# EAGLE design board (EAGLE 6.5.0)
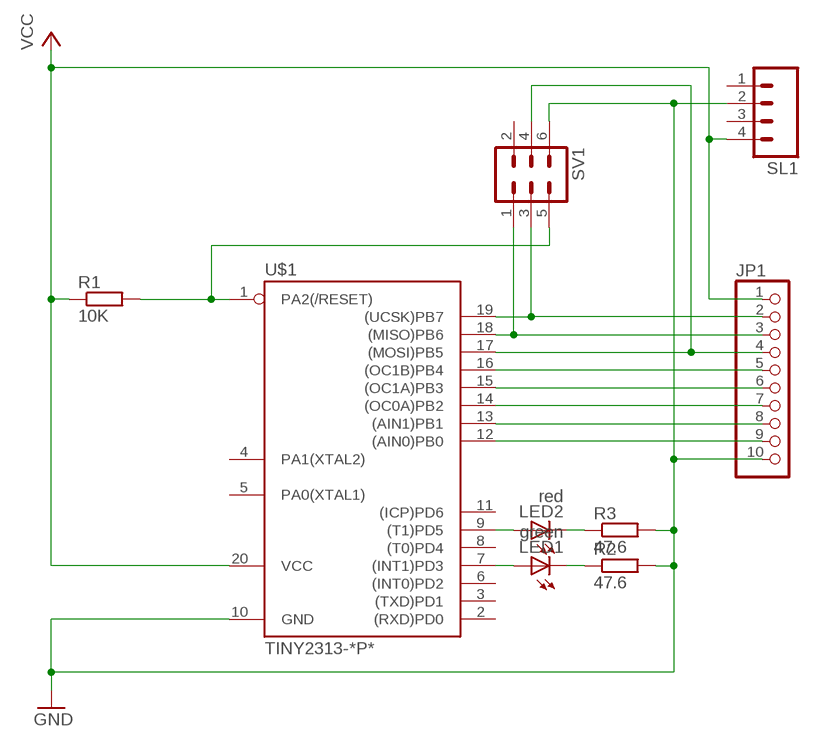
[diagram p0: schematic, sheet 1]

## Parts
JP1  PINHD-1X10  [1X10]
LED1  green  LED3MM  [LED3MM]
LED2  red  LED3MM  [LED3MM]
R1  10K  R-EU_0207/2V  [0207/2V]
R2  47.6  R-EU_0207/2V  [0207/2V]
R3  47.6  R-EU_0207/2V  [0207/2V]
SL1  M04  [04P]
SV1  ML6  [ML6]
U$1  TINY2313-*P*  [DIL20]

## Nets
GND: JP1.10 R2.2 R3.2 SL1.2 SV1.6 U$1.10(GND)
N$1: R1.2 SV1.5 U$1.1(PA2(/RESET))
N$2: LED2.A U$1.9((T1)PD5)
N$3: LED1.K(C) R2.1
N$4: LED1.A U$1.7((INT1)PD3)
N$5: LED2.K(C) R3.1
N$6: JP1.3 SV1.1 U$1.18((MISO)PB6)
N$7: JP1.2 SV1.3 U$1.19((UCSK)PB7)
N$9: JP1.4 SV1.4 U$1.17((MOSI)PB5)
N$12: JP1.5 U$1.16((OC1B)PB4)
N$13: JP1.6 U$1.15((OC1A)PB3)
N$14: JP1.7 U$1.14((OC0A)PB2)
N$15: JP1.8 U$1.13((AIN1)PB1)
N$16: JP1.9 U$1.12((AIN0)PB0)
VCC: JP1.1 R1.1 SL1.4 U$1.20(VCC)
Unconnected: SL1.1 SL1.3 SV1.2 U$1.2((RXD)PD0) U$1.3((TXD)PD1) U$1.4(PA1(XTAL2)) U$1.5(PA0(XTAL1)) U$1.6((INT0)PD2) U$1.8((T0)PD4) U$1.11((ICP)PD6)

## Library data of the parts
JP1 = pinhead:PINHD-1X10: PIN HEADER
LED1 LED2 = led:LED: LED OSRAM: - CHIPLED LG R971, LG N971, LY N971, LG Q971, LY Q971, LO R971, LY R971 LH N974, LH R974 LS Q976, LO Q976, LY Q976 LO Q996 - Hyper CHIPLED LW Q18S LB Q993, LB Q99A, LB R99A - SideLED LS A670, LO A670, LY A670, LG A670, LP A670 LB A673, LV A673, LT A673, LW A673 LH A674 LY A675 LS A676, LA A676, LO A676, LY A676, LW A676 LS A679, LY A679, LG A679 - Hyper Micro SIDELED® LS Y876, LA Y876, LO Y876, LY Y876 LT Y87S - SmartLED LW L88C, LW L88S LB L89C, LB L89S, LG L890 LS L89K, LO L89K, LY L89K LS L896, LA L896, LO L896, LY L896 - TOPLED LS T670, LO T670, LY T670, LG T670, LP T670 LSG T670, LSP T670, LSY T670, LOP T670, LYG T670 LG T671, LOG T671, LSG T671 LB T673, LV T673, LT T673, LW T673 LH T674 LS T676, LA T676, LO T676, LY T676, LB T676, LH T676, LSB T676, LW T676 LB T67C, LV T67C, LT T67C, LS T67K, LO T67K, LY T67K, LW E67C LS E67B, LA E67B, LO E67B, LY E67B, LB E67C, LV E67C, LT E67C LW T67C LS T679, LY T679, LG T679 LS T770, LO T770, LY T770, LG T770, LP T770 LB T773, LV T773, LT T773, LW T773 LH T774 LS E675, LA E675, LY E675, LS T675 LS T776, LA T776, LO T776, LY T776, LB T776 LHGB T686 LT T68C, LB T68C - Hyper Mini TOPLED® LB M676 - Mini TOPLED Santana® LG M470 LS M47K, LO M47K, LY M47K Source: http://www.osram.convergy.de LUXEON: - LUMILED® LXK2-PW12-R00, LXK2-PW12-S00, LXK2-PW14-U00, LXK2-PW14-V00 LXK2-PM12-R00, LXK2-PM12-S00, LXK2-PM14-U00 LXK2-PE12-Q00, LXK2-PE12-R00, LXK2-PE12-S00, LXK2-PE14-T00, LXK2-PE14-U00 LXK2-PB12-K00, LXK2-PB12-L00, LXK2-PB12-M00, LXK2-PB14-N00, LXK2-PB14-P00, LXK2-PB14-Q00 LXK2-PR12-L00, LXK2-PR12-M00, LXK2-PR14-Q00, LXK2-PR14-R00 LXK2-PD12-Q00, LXK2-PD12-R00, LXK2-PD12-S00 LXK2-PH12-R00, LXK2-PH12-S00 LXK2-PL12-P00, LXK2-PL12-Q00, LXK2-PL12-R00 Source: www.luxeon.com KINGBRIGHT: KA-3528ASYC Source: www.kingbright.com
R1-R3 = rcl:R-EU_: RESISTOR, European symbol
SL1 = con-amp-quick:M04: AMP QUICK CONNECTOR; OC_FARNELL: unknown; OC_NEWARK: unknown
SV1 = con-ml:ML6: HARTING; OC_FARNELL: unknown; OC_NEWARK: unknown
U$1 = avr-7:TINY2313*: Atmel Tiny2313 2K Flash, 128 bytes EEPROM, 128 bytes RAM

## Board
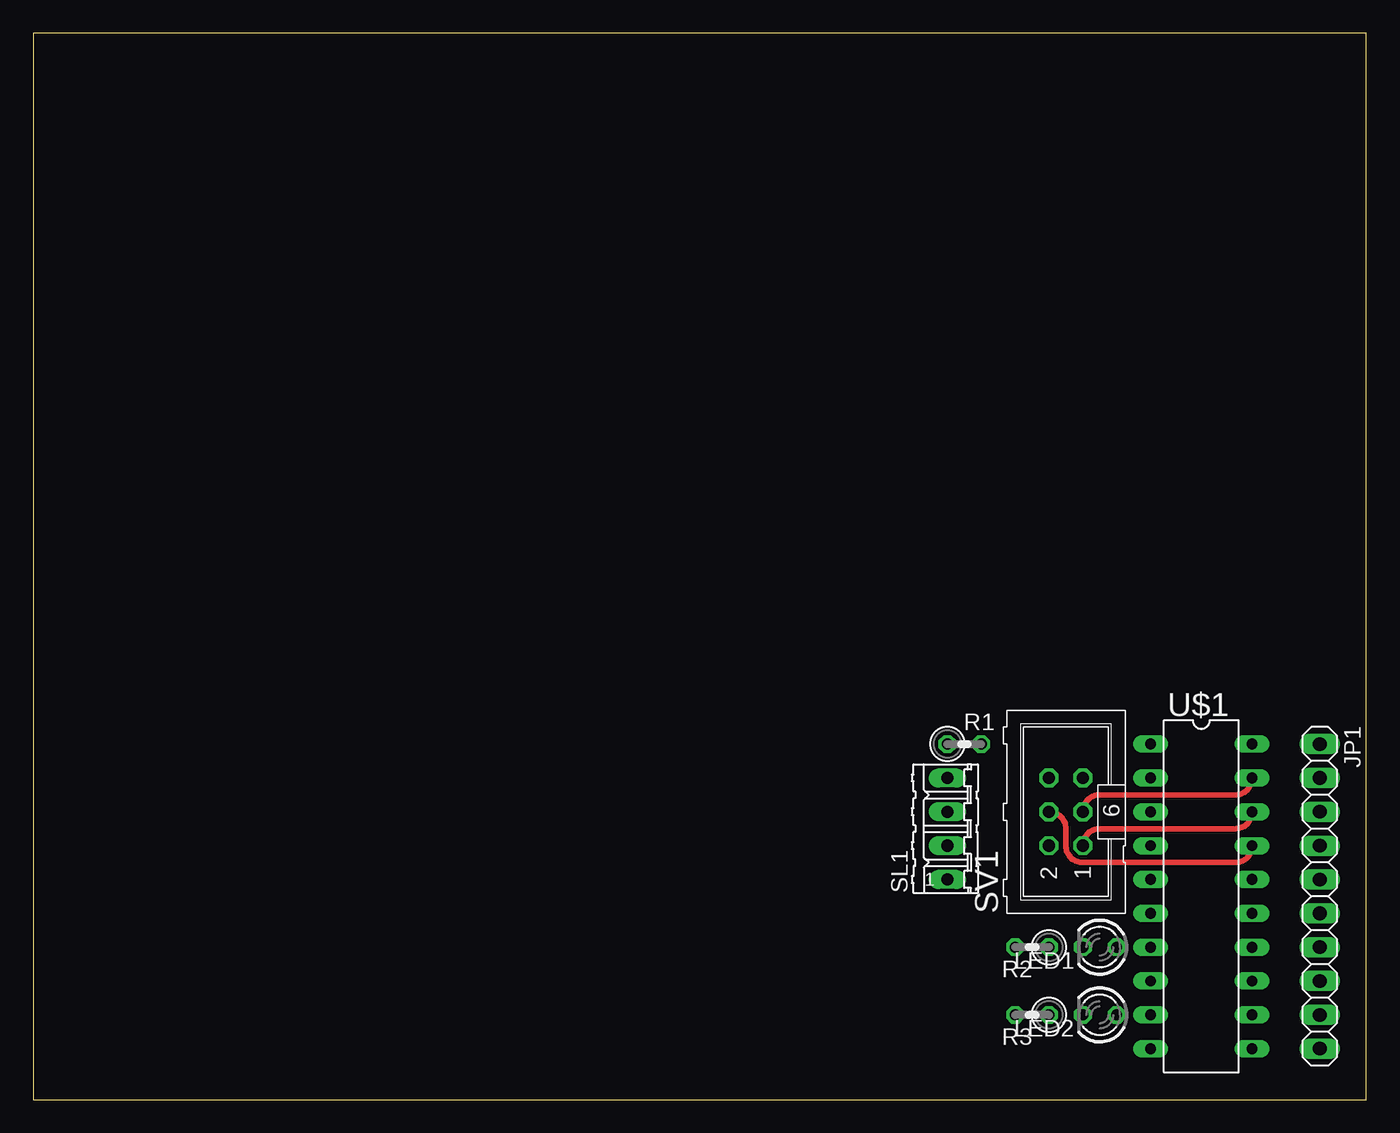
[diagram p1: board, top side]
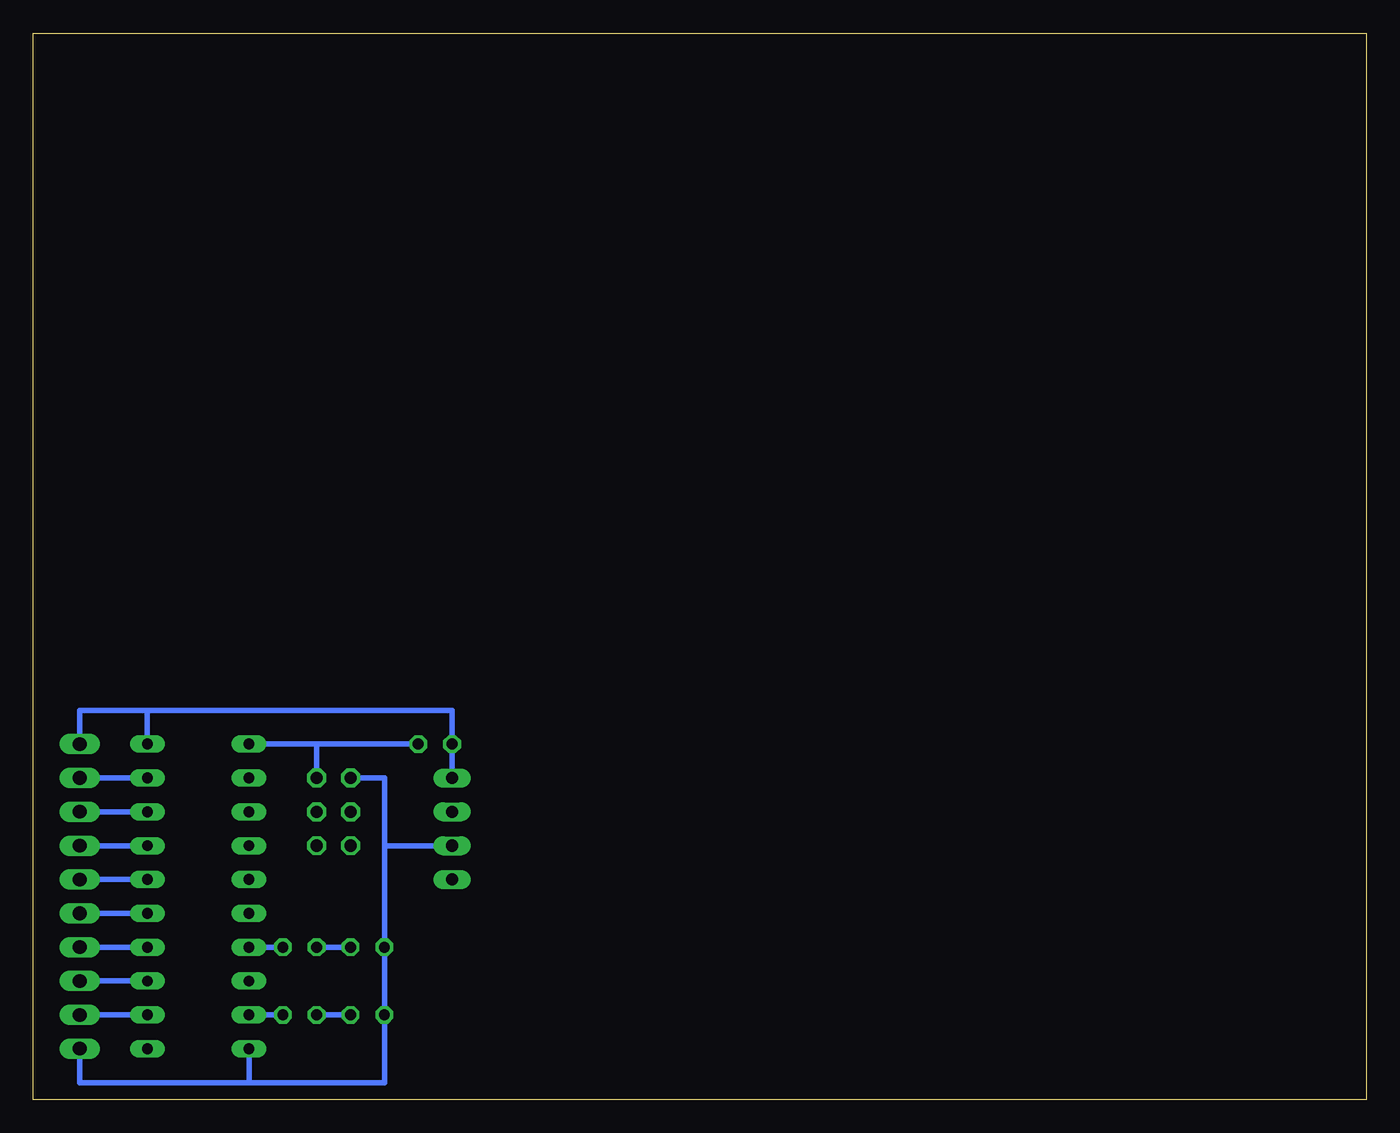
[diagram p2: board, bottom side, seen from below]

Size 100 x 80 mm. Coordinates in mm from the lower left corner, seen from the top.
Outline: 0,0 100,0 100,80 0,80 0,0
Copper layers (1*16): Top 0.035mm / dielectric 1.5mm / Bottom 0.035mm
Design rules "default": minimum track width 10mil, minimum drill 24mil, track to track 8mil, track to pad 8mil, pad to pad 8mil, via to via 8mil, smd to smd 8mil, copper to edge 40mil, drill to drill 8mil, minimum pad ring 10mil, minimum via ring 8mil, stop-mask expansion 4mil, vias tented up to drill 0mil, thermal gap 10mil

### Footprints (pad centres in the part's own frame; a part is rotated, then mirrored left to right if it is on the bottom)
1X10 = drill 1.016 long: 1 -11.43,0; 2 -8.89,0; 3 -6.35,0; 4 -3.81,0; 5 -1.27,0; 6 1.27,0; 7 3.81,0; 8 6.35,0; 9 8.89,0; 10 11.43,0
LED3MM = drill 0.813 octagon: A -1.27,0; K 1.27,0
0207/2V = drill 0.813 octagon: 1 -1.27,0; 2 1.27,0
04P = drill 0.914 long: 1 -3.81,0; 2 -1.27,0; 3 1.27,0; 4 3.81,0
ML6 = drill 0.914 octagon: 1 -2.54,-1.27; 2 -2.54,1.27; 3 0,-1.27; 4 0,1.27; 5 2.54,-1.27; 6 2.54,1.27
DIL20 = drill 0.813 long: 1 -11.43,-3.81; 2 -8.89,-3.81; 3 -6.35,-3.81; 4 -3.81,-3.81; 5 -1.27,-3.81; 6 1.27,-3.81; 7 3.81,-3.81; 8 6.35,-3.81; 9 8.89,-3.81; 10 11.43,-3.81; 11 11.43,3.81; 12 8.89,3.81; 13 6.35,3.81; 14 3.81,3.81; 15 1.27,3.81; 16 -1.27,3.81; 17 -3.81,3.81; 18 -6.35,3.81; 19 -8.89,3.81; 20 -11.43,3.81

### Placement (x,y rotation side)
JP1  96.52,15.24 270 top
LED1  80.01,11.43 180 top
LED2  80.01,6.35 180 top
R1  69.85,26.67 0 top
R2  74.93,11.43 180 top
R3  74.93,6.35 180 top
SL1  68.58,20.32 90 top
SV1  77.47,21.59 90 top
U$1  87.63,15.24 270 top

### Tracks (layer width: path | path; a pad name or v marks a point on that pad's centre or on a via)
GND
  Bottom 0.406: 83.82,1.27 73.66,1.27 R3.2 R2.2 73.66,19.05 | JP1.10 96.52,1.27 83.82,1.27 | 83.82,1.27 U$1.10 | 73.66,19.05 73.66,24.13 SV1.6 | SL1.2 73.66,19.05
N$1
  Bottom 0.406: SV1.5 78.74,26.67 | 78.74,26.67 U$1.1 | R1.2 78.74,26.67
N$2
  Bottom 0.406: LED2.A U$1.9
N$3
  Bottom 0.406: R2.1 LED1.K
N$4
  Bottom 0.406: LED1.A U$1.7
N$5
  Bottom 0.406: LED2.K R3.1
N$6
  Top 0.406: U$1.18 arc-90 90.17,20.32 80.01,20.32 arc90 SV1.1
  Bottom 0.406: U$1.18 JP1.3
N$7
  Top 0.406: U$1.19 arc-90 90.17,22.86 80.01,22.86 arc90 SV1.3
  Bottom 0.406: JP1.2 U$1.19
N$9
  Top 0.406: U$1.17 arc-90 90.17,17.78 78.74,17.78 arc-90 77.47,19.05 77.47,20.32 arc90 SV1.4
  Bottom 0.406: JP1.4 U$1.17
N$12
  Bottom 0.406: U$1.16 JP1.5
N$13
  Bottom 0.406: JP1.6 U$1.15
N$14
  Bottom 0.406: U$1.14 JP1.7
N$15
  Bottom 0.406: JP1.8 U$1.13
N$16
  Bottom 0.406: U$1.12 JP1.9
VCC
  Bottom 0.406: JP1.1 96.52,29.21 91.44,29.21 | SL1.4 R1.1 68.58,29.21 91.44,29.21 | U$1.20 91.44,29.21